# Altium schematic sheet QSPI Flash.SchDoc
size C; SheetNumber: 6; SheetTotal: 6
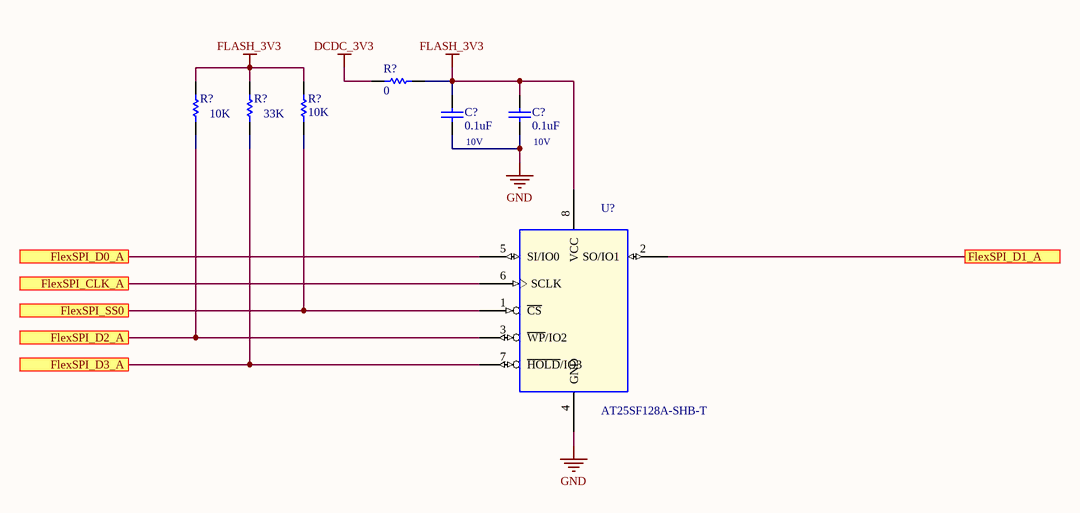
[diagram p0: QSPI Flash.SchDoc]

## Parts
(Parts that share a designator on the sheet are numbered #1, #2 ... from top to bottom, then left to right.)
C?#1  value 0.1uF  Voltage: 10V  (hidden comment: Capacitor)
C?#2  value 0.1uF  Voltage: 10V  (hidden comment: Capacitor)
R?#1  value 0  (hidden comment: Resistor)
R?#2  value 10K  (hidden comment: Resistor)
R?#3  value 33K  (hidden comment: Resistor)
R?#4  value 10K  (hidden comment: Resistor)
U?  AT25SF128A-SHB-T  [SO8-25X75-200]

## Ports
FlexSPI_CLK_A, FlexSPI_D0_A, FlexSPI_D1_A, FlexSPI_D2_A, FlexSPI_D3_A, FlexSPI_SS0

## Nets
DCDC_3V3: R?#1.2
FLASH_3V3: C?#1.2 C?#2.2 R?#1.1 R?#2.2 R?#3.2 R?#4.2 U?.8(VCC)
GND: C?#1.1 C?#2.1 U?.4(GND)
FlexSPI_CLK_A: U?.6(SCLK) ; port FlexSPI_CLK_A
FlexSPI_D0_A: U?.5(SI/IO0) ; port FlexSPI_D0_A
FlexSPI_D1_A: U?.2(SO/IO1) ; port FlexSPI_D1_A
FlexSPI_D2_A: R?#2.1 U?.3(~{WP}/IO2) ; port FlexSPI_D2_A
FlexSPI_D3_A: R?#3.1 U?.7(~{HOLD}/IO3) ; port FlexSPI_D3_A
FlexSPI_SS0: R?#4.1 U?.1(~{CS}) ; port FlexSPI_SS0

## Library data of the parts
C?#1 C?#2 = Capacitor: SimulationGenericComponent: True
R?#1 = Resistor: SimulationGenericComponent: True; TC1: 0; TC2: 0
R?#2-R?#4 = Resistor: TC1: 0; SimulationGenericComponent: True; TC2: 0
U? = AT25SF128A: IC MEM NOR FLASH DUAL/QUAD SPI 128MBIT 133MHZ 2.7-3.6V SOP8; AGILE_PN: 342-00805; MFG_NAME01: Adesto Technologies Corporation, Inc; Temp_Range: -40¡ãC ~ 85¡ãC; CAD_APPROVED: Yes; CLASS: IC; MFG_PN01: AT25SF128A-SHB-T; ROHS: Yes; HEIGHT: 2.16MM; PCB Footprint: SO8-25X75-200